# EAGLE design continuity_tester (EAGLE 6.6.0)
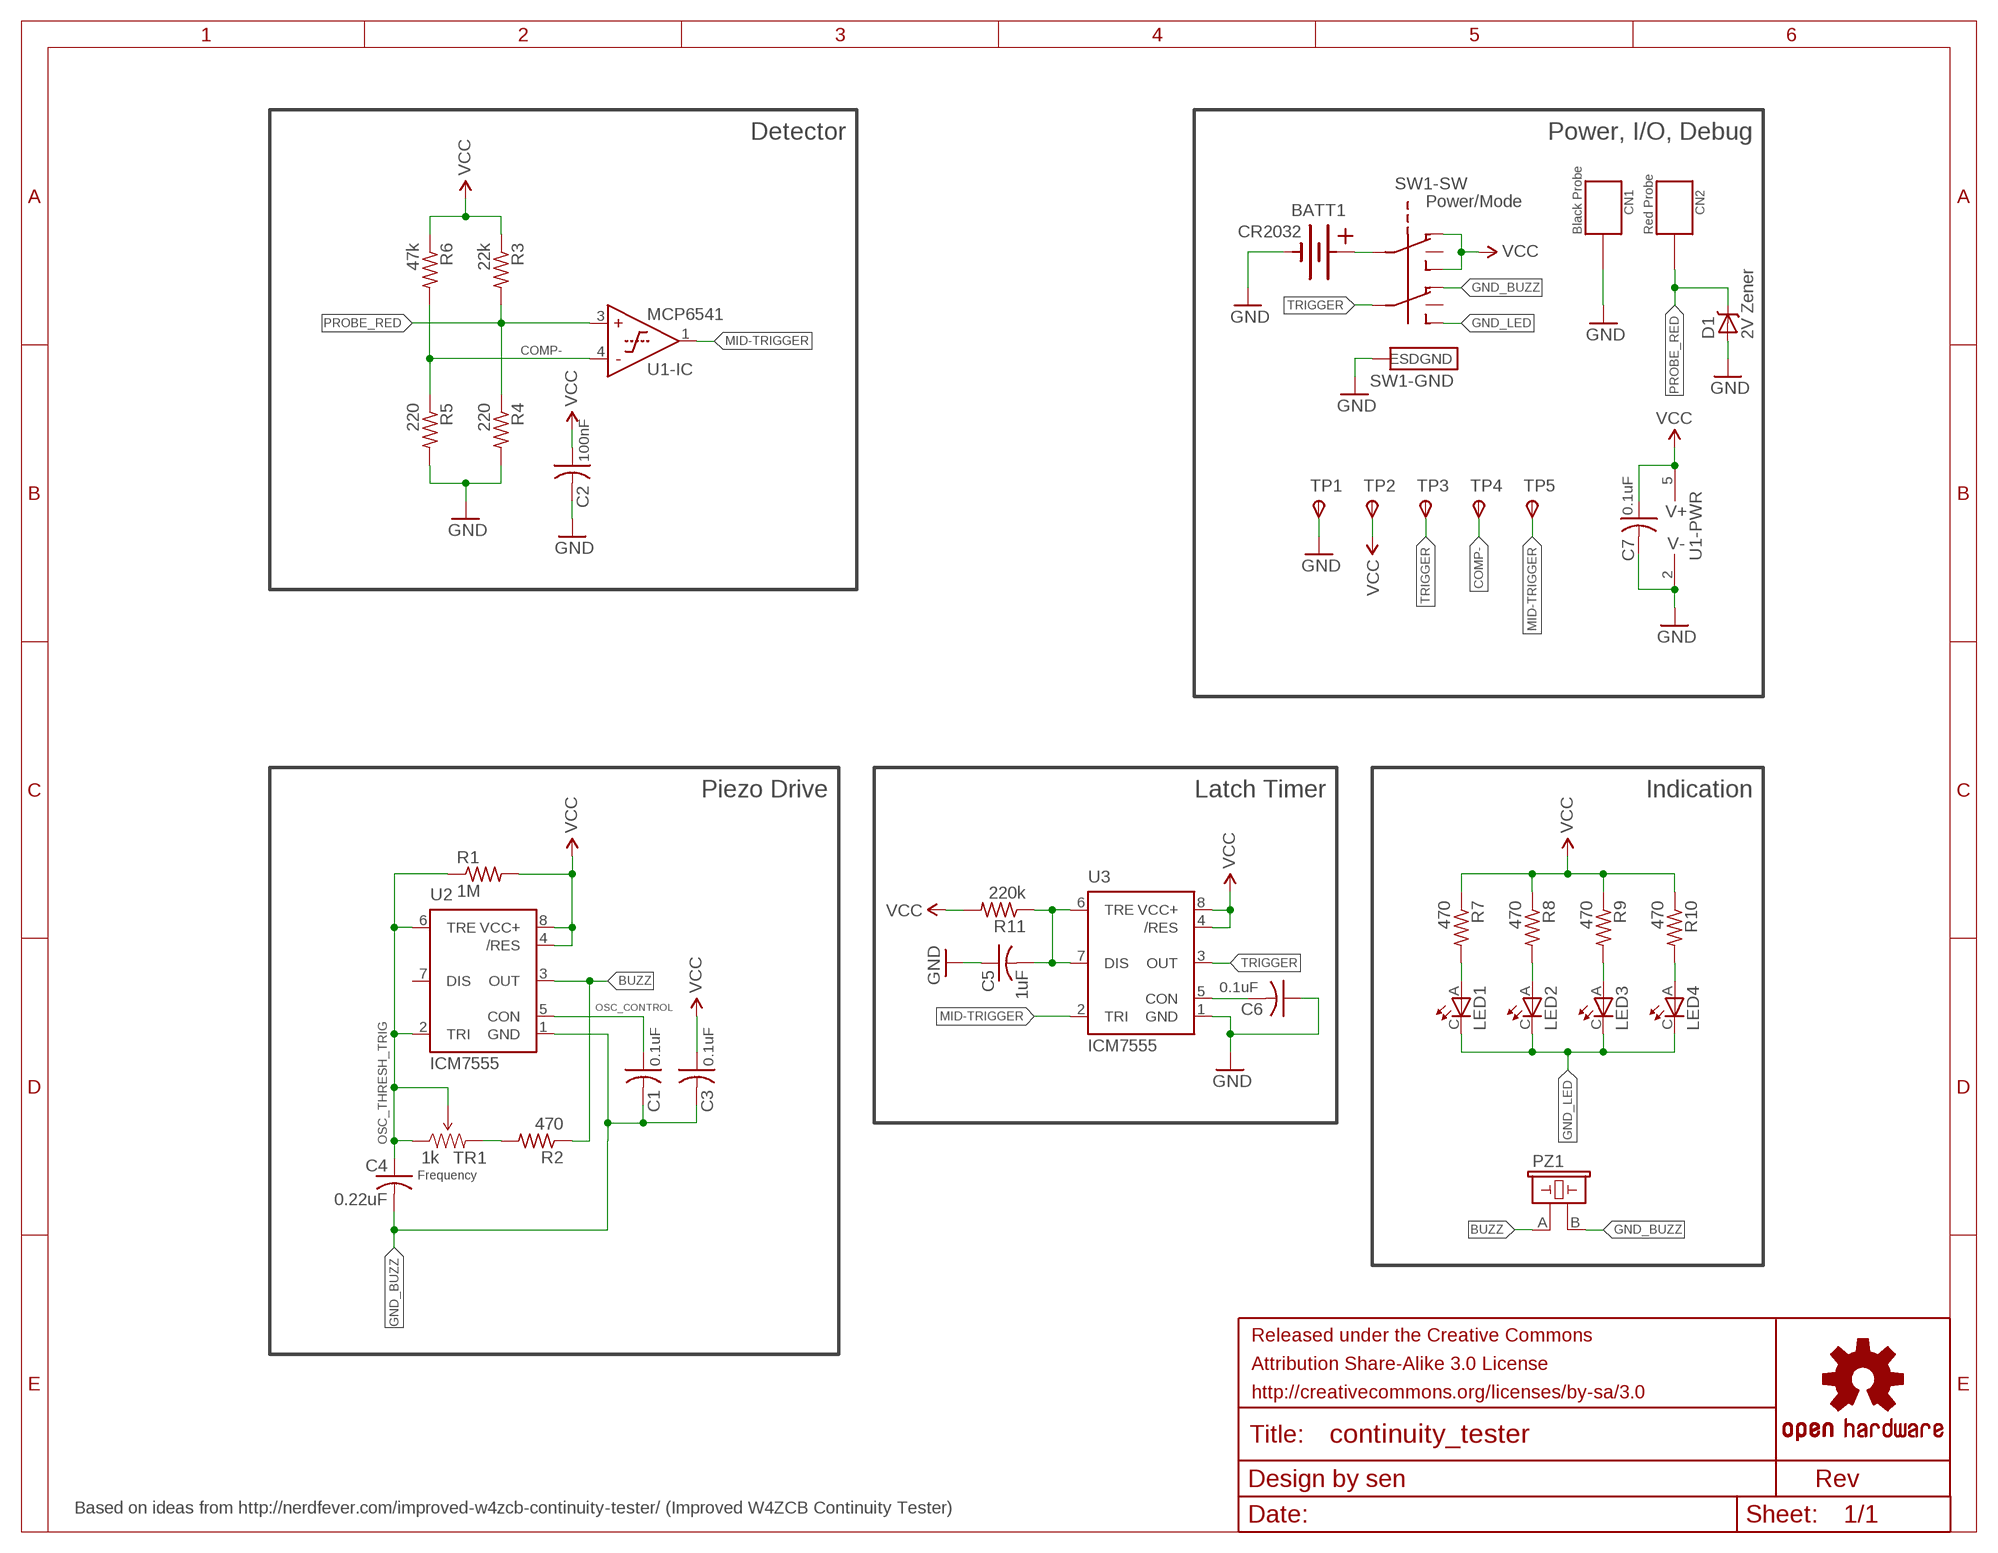
[diagram p0: schematic, sheet 1]

## Parts
BATT1  CR2032  [BK-912-CR2032]
C1  0.1uF  C-USC0603  [C0603]
C2  100nF  C-USC0603  [C0603]
C3  0.1uF  C-USC0603  [C0603]
C4  0.22uF  C-USC0603  [C0603]
C5  1uF  C-USC0603  [C0603]
C6  0.1uF  C-USC0603  [C0603]
C7  0.1uF  C-USC0603  [C0603]
CN1  Black Probe  CALTEST-CT3151  [CALTEST-CT3151]
CN2  Red Probe  CALTEST-CT3151  [CALTEST-CT3151]
D1  2V Zener  ZENER  [DO-219AC]
FRAME1  FRAME-LETTER-GRID-OSHW-SENOSHW-LOGO-L  [OSHW-LOGO-L]
LED1  LITEON-LTST020  [LITEON-LTST020]
LED2  LITEON-LTST020  [LITEON-LTST020]
LED3  LITEON-LTST020  [LITEON-LTST020]
LED4  LITEON-LTST020  [LITEON-LTST020]
PZ1  MURATA-PKMCS0909  [MURATA-PKMCS0909]
R1  1M  R-US_R0603  [R0603]
R2  470  R-US_R0603  [R0603]
R3  22k  R-US_R0603  [R0603]
R4  220  R-US_R0603  [R0603]
R5  220  R-US_R0603  [R0603]
R6  47k  R-US_R0603  [R0603]
R7  470  R-US_R0603  [R0603]
R8  470  R-US_R0603  [R0603]
R9  470  R-US_R0603  [R0603]
R10  470  R-US_R0603  [R0603]
R11  220k  R-US_R0603  [R0603]
SW1  Power/Mode  ESWITCH-EG2308  [ESWITCH-EG2308]
TP1  GND  TPSB1,27  [B1,27]
TP2  VCC  TPSB1,27  [B1,27]
TP3  TRIGGER  TPSB1,27  [B1,27]
TP4  COMP-  TPSB1,27  [B1,27]
TP5  MID-TRIGGER  TPSB1,27  [B1,27]
TR1  1k  NIDEC-ST4EA  [NIDEC-ST4EA]
U1  MCP6541  [SOT23-5]
U2  ICM7555  NE555D  [SO08]
U3  ICM7555  NE555D  [SO08]

## Nets
BUZZ: PZ1.A R2.1 U2.3(OUT)
COMP-: R5.1 R6.2 TP4.TP(PP) U1.4(-IC:IN-)
GND: BATT1.-(-1) C2.2 C5.1 C6.1 C7.2 CN1.A CN1.B CN1.C CN1.D D1.A R4.2 R5.2 SW1.SUPPORT1(-GND:ESDGND) SW1.SUPPORT2(-GND:ESDGND) TP1.TP(PP) U1.2(-PWR:V-) U3.1(GND)
GND_BUZZ: C1.2 C3.2 C4.2 PZ1.B SW1.5(-SW:2A) U2.1(GND)
GND_LED: LED1.C LED2.C LED3.C LED4.C SW1.8(-SW:2C)
LED1_R: LED1.A R7.2
LED2_R: LED2.A R8.2
LED3_R: LED3.A R9.2
LED4_R: LED4.A R10.2
MID-TRIGGER: TP5.TP(PP) U1.1(-IC:OUT) U3.2(TRI)
OSC_CONTROL: C1.1 U2.5(CON)
OSC_THRESH_TRIG: C4.1 R1.1 TR1.CCW TR1.WIPER U2.2(TRI) U2.6(TRE)
PROBE_RED: CN2.A CN2.B CN2.C CN2.D D1.K(C) R3.2 R4.1 U1.3(-IC:IN+)
TR1_R2: R2.2 TR1.CW
TRIGGER: SW1.7 TP3.TP(PP) U3.3(OUT)
U3-CON: C6.2 U3.5(CON)
U3-TREDIS: C5.2 R11.1 U3.6(TRE) U3.7(DIS)
VCC: C2.1 C3.1 C7.1 R1.2 R3.1 R6.1 R7.1 R8.1 R9.1 R10.1 R11.2 SW1.1(-SW:1A) SW1.4(-SW:1C) TP2.TP(PP) U1.5(-PWR:V+) U2.4(/RES) U2.8(VCC+) U3.4(/RES) U3.8(VCC+)
VCC_PRESWITCH: BATT1.+1(+2) SW1.3
Unconnected: SW1.2(-SW:1B) SW1.6(-SW:2B) U2.7(DIS)

## Notes on the sheet
- Detector | Power, I/O, Debug
- Piezo Drive | Latch Timer | Indication
- Frequency
- Based on ideas from http://nerdfever.com/improved-w4zcb-continuity-tester/ (Improved W4ZCB Continuity Tester)

## Library data of the parts
BATT1 = con-sen:CR2032
C1-C7 = adafruit:C-US: CAPACITOR, American symbol
CN1 CN2 = con-sen:CALTEST-CT3151: Cal Test CT3151 safety banana jack
D1 = diode-sen:ZENER: Zener diode in various packages.
FRAME1 = logos-sen:FRAME-LETTER-GRID-OSHW-SEN: Landscape letter-sized schematic frame w/ OSHW logo, edge grid; REV: 002
LED1-LED4 = led-sen:LITEON-LTST020: Right-angle SMD LED
PZ1 = speaker-sen:MURATA-PKMCS0909: Externally excited piezo transducer
R1-R11 = adafruit:R-US_: RESISTOR, American symbol
SW1 = switch-sen:ESWITCH-EG2308: DP3T Slide Switch
TP1-TP5 = testpad:TPS: TEST PIN
TR1 = rcl-sen:NIDEC-ST4EA: SMD trimpot
U1 = microchip-sen:MCP6541: MCP6541 Push-Pull Output Sub-Microamp Comparator
U2 U3 = SparkFun-AnalogIC:NE555: General purpose bipolar Timer

## Board
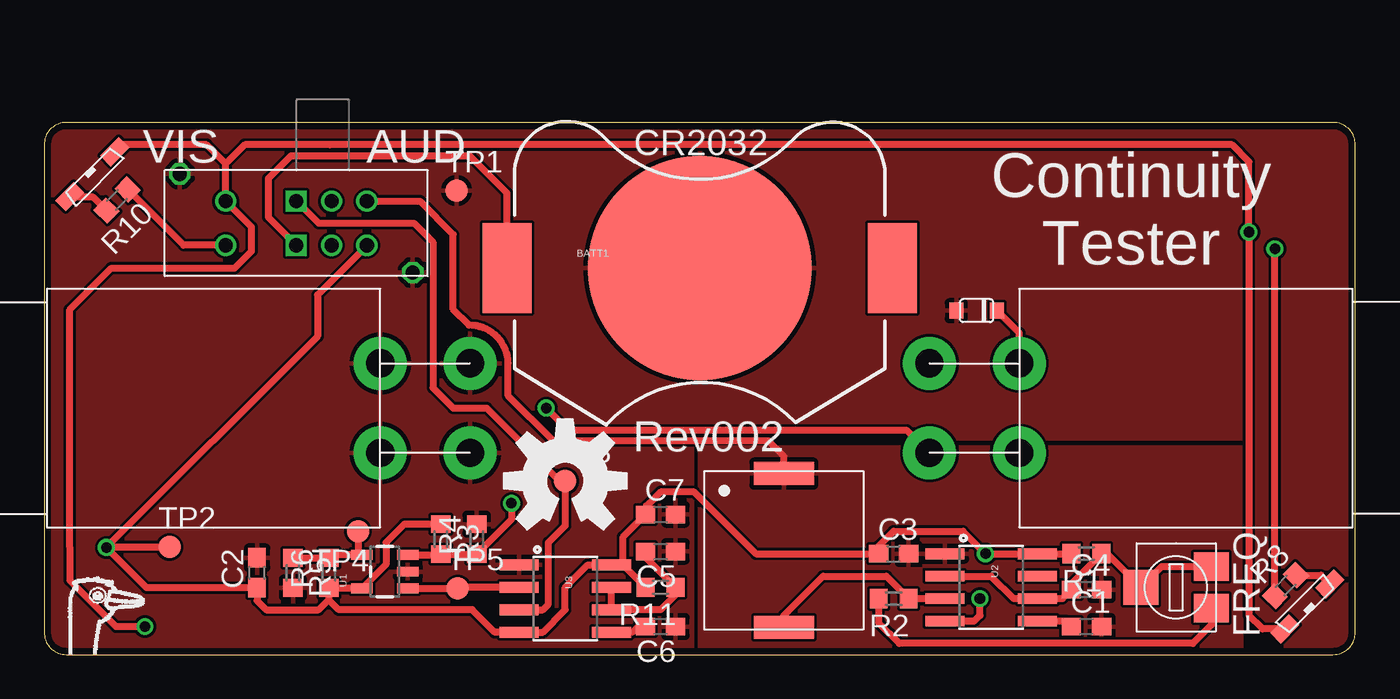
[diagram p1: board, top side]
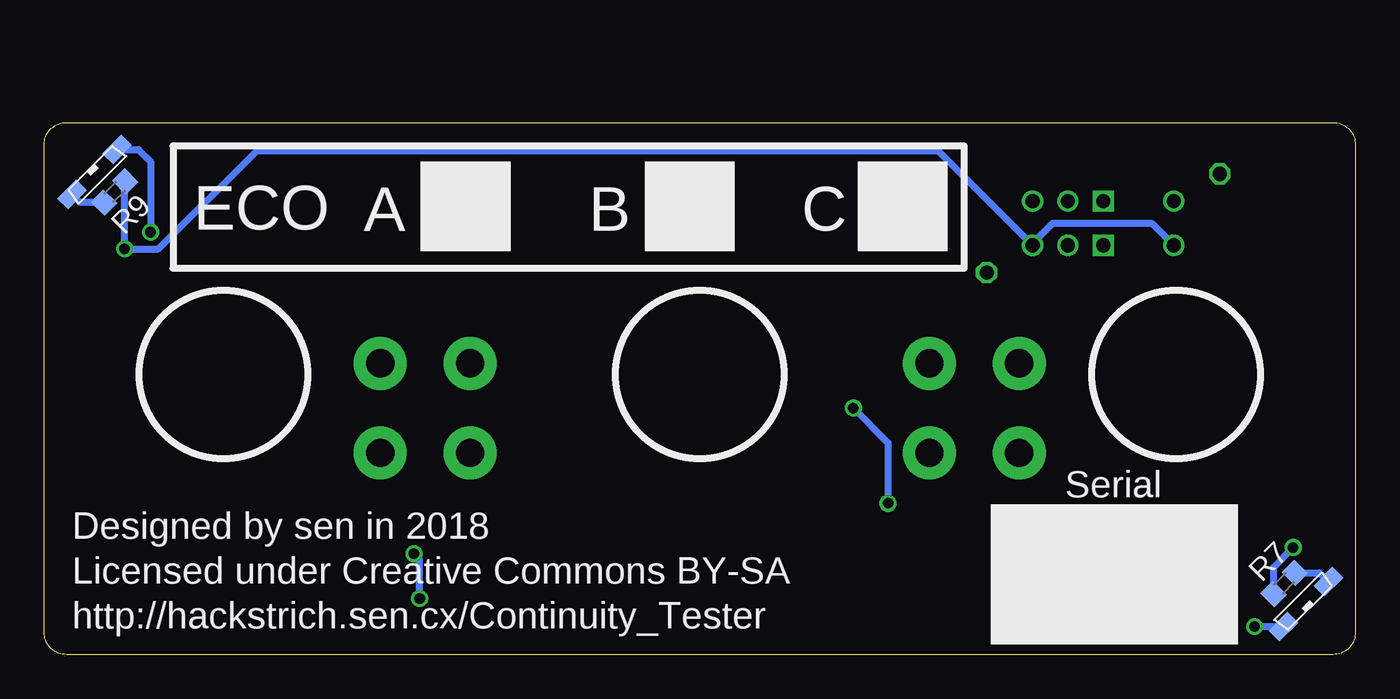
[diagram p2: board, bottom side, seen from below]

Size 74.3 x 30.16 mm. Coordinates in mm from the lower left corner, seen from the top.
Outline: 0,28.89 0,1.27 arc90 1.27,0 73.03,0 arc90 74.3,1.27 74.3,28.89 arc90 73.03,30.16 1.27,30.16 arc90 0,28.89
Copper layers (1*16): Top 0.0356mm / dielectric 1.5011mm / Bottom 0.0356mm
Design rules "LaenPCBOrder-sen *": minimum track width 6mil, minimum drill 13mil, track to track 6mil, track to pad 6mil, pad to pad 6mil, via to via 6mil, smd to smd 6mil, copper to edge 15mil, drill to drill 6mil, minimum pad ring 7mil, minimum via ring 7mil, stop-mask expansion 4mil, vias tented up to drill 25mil, thermal gap 10mil

### Footprints (pad centres in the part's own frame; a part is rotated, then mirrored left to right if it is on the bottom)
BK-912-CR2032 = smd 2.794 x 5.08: +1 -10.922,0; +2 10.922,0 | smd 12.7 x 12.7: - 0,0
C0603 = smd 1.1 x 1: 1 -0.85,0; 2 0.85,0
CALTEST-CT3151 = drill 1.6 pad 3: A 0,2.54; B 5.08,2.54; C 0,-2.54; D 5.08,-2.54
DO-219AC = smd 0.8 x 0.9: A 1.15,0; K -1.15,0
LITEON-LTST020 = smd 1.5 x 0.85: A 1.8,0; C -1.8,0
MURATA-PKMCS0909 = smd 1.3 x 3.4: A -4.35,0; B 4.35,0
R0603 = smd 1 x 1.1: 1 -0.85,0; 2 0.85,0
ESWITCH-EG2308 = drill 0.8: 1 -4,1.25; 2 -2,1.25; 4 4,1.25; 5 -4,-1.25; 6 -2,-1.25; 8 4,-1.25 | drill 0.8 square: 3 0,1.25; 7 0,-1.25 | drill 0.8 octagon: SUPPORT1 -6.6,2.8; SUPPORT2 6.6,-2.8
B1,27 = smd 1.27 x 1.27: TP 0,0
NIDEC-ST4EA = smd 1.6 x 2: CCW 1.175,-2; CW -1.175,-2 | smd 2 x 2: WIPER 0,2
SOT23-5 = smd 0.55 x 1.2: 1 -0.95,-1.3; 2 0,-1.3; 3 0.95,-1.3; 4 0.95,1.3; 5 -0.95,1.3
SO08 = smd 0.61 x 2.21: 1 -1.905,-2.616; 2 -0.635,-2.616; 3 0.635,-2.616; 4 1.905,-2.616; 5 1.905,2.616; 6 0.635,2.616; 7 -0.635,2.616; 8 -1.905,2.616

### Placement (x,y rotation side)
BATT1  37.15,21.91 0 top
C1  59.05,1.59 0 top
C2  12.06,4.64 90 top
C3  48.13,5.71 0 top
C4  59.05,3.68 0 top
C5  34.92,5.84 180 top
C6  34.92,1.59 180 top
C7  34.92,7.94 0 top
CN1  19.05,13.97 0 top
CN2  55.24,13.97 180 top
D1  52.83,19.49 180 top
FRAME1  29.53,9.84 0 top
LED1  2.8,2.86 45 bottom
LED2  71.57,2.73 45 top
LED3  71.44,27.36 225 bottom
LED4  2.73,27.23 225 top
PZ1  41.91,5.91 90 top
R1  59.05,5.71 180 top
R2  48.13,3.17 180 top
R3  22.48,6.54 270 top
R4  24.51,6.54 90 top
R5  14.1,4.64 270 top
R6  16.13,4.64 90 top
R7  4.03,4.03 45 bottom
R8  70.34,3.9 45 top
R9  70.3,26.22 225 bottom
R10  4.13,25.77 225 top
R11  34.92,3.81 180 top
SW1  14.29,24.45 180 top
TP1  23.37,26.29 0 top
TP2  7.11,6.1 0 top
TP3  29.53,9.84 0 top
TP4  17.78,6.99 180 top
TP5  23.43,3.75 0 top
TR1  64.14,3.81 90 top
U1  19.3,4.7 90 top
U2  53.66,3.81 270 top
U3  29.53,3.17 270 top
U$1  [STRICH-LOGO-R]  2.16,2.03 0 top

### Tracks (layer width: path | path; a pad name or v marks a point on that pad's centre or on a via)
BUZZ
  Top 0.406: U2.3 R2.1 47.71,4.45 44.13,4.45 41.91,2.22 PZ1.A
COMP-
  Top 0.406: R5.1 R6.2 16.29,5.65 U1.4 17.78,5.87 TP4.TP
GND
  pour Top: 0,30.16 74.3,30.16 74.3,0 68.26,0 68.26,12.26 36.7,12.26 36.7,0.32 0,0
GND_BUZZ
  Top 0.406: SW1.5 21.29,25.7 23.18,23.81 23.18,19.56 24.07,18.67 arc-90 26.29,16.51 26.29,14.67 28.83,12.13 41.02,12.13 41.91,11.24 PZ1.B
  pour Top: 37.15,11.75 67.82,11.75 67.82,0.32 37.15,0.32
GND_LED  (via drill 0.6)
  Top 0.406: LED4.C 4.39,28.89 9.21,28.89 10.29,27.81 | 10.29,27.81 SW1.8 11.75,24.24 11.75,22.86 10.79,21.91 3.81,21.91 1.45,19.55 1.45,6.07 1.45,4.21 LED1.C v5.71,1.58 | 10.29,27.81 11.37,28.89 16.19,28.89 67.31,28.89 68.27,27.94 v68.27,23.95 68.27,2.23 69.04,1.45 LED2.C
  Bottom 0.406: LED3.C 68.96,28.63 68.27,27.94 v68.27,23.95 | LED1.C v5.71,1.58
LED1_R
  Bottom 0.406: R7.2 2.04,4.64 LED1.A
LED2_R
  Top 0.406: R8.2 72.34,4.5 LED2.A
LED3_R
  Bottom 0.406: R9.2 72.24,25.62 LED3.A
LED4_R
  Top 0.406: LED4.A 2.74,25.95 R10.2
MID-TRIGGER
  Top 0.406: U1.1 TP5.TP 23.5,3.81 U3.2
OSC_CONTROL
  Top 0.406: U2.5 57.89,1.91 C1.1
OSC_THRESH_TRIG
  Top 0.406: TR1.CCW 63.31,4.99 TR1.WIPER 60.23,5.71 R1.1 58.2,4.01 C4.1 57.7,3.17 U2.6 54.93,3.17 53.66,4.45 U2.2
PROBE_RED  (via drill 0.6)
  Top 0.406: U1.3 22.44,5.65 R3.2 R4.1 25.49,6.67 26.48,7.66 v26.48,8.57 | CN2.C 55.24,18.23 D1.K | CN2.B 48.9,12.7 29.78,12.7 29.72,12.7 v28.45,13.97
  Bottom 0.406: v28.45,13.97 26.48,12 v26.48,8.57
TR1_R2
  Top 0.406: TR1.CW 66.14,1.68 65.09,0.64 48.45,0.64 47.28,1.8 R2.2
TRIGGER
  Top 0.406: U3.3 28.26,2.54 28.57,2.86 28.57,6.35 29.53,7.3 TP3.TP 29.53,9.53 25.08,13.97 23.18,13.97 22.04,15.11 22.04,23.37 20.95,24.45 15.56,24.45 14.31,25.7 SW1.7
U3-CON
  Top 0.406: C6.2 33.66,1.59 33.34,1.27 U3.5
U3-TREDIS
  Top 0.406: U3.7 U3.6 34.92,2.54 35.77,3.39 R11.1 34.08,5.51 C5.2
VCC  (via drill 0.6)
  Top 0.406: U2.4 52.39,1.91 52.7,1.91 53.02,2.22 v53.02,3.17 | v53.34,5.71 U2.8 R1.2 | 16.13,3.11 R6.1 16.17,3.75 U1.5 19.37,5.11 19.37,6.35 20.41,7.39 R3.1 | 16.13,3.11 15.56,2.54 12.57,2.54 12.06,3.05 C2.1 5.81,3.79 v3.53,6.07 3.56,6.1 | v53.34,5.71 52.07,6.99 48.13,6.99 47.28,6.13 C3.1 40.32,5.71 36.83,9.21 34.92,9.21 34.29,8.57 34.08,8.36 | 32.8,5.08 U3.8 30.8,5.08 29.53,3.81 29.53,2.54 28.26,1.27 U3.4 25.53,1.27 24.26,2.54 16.7,2.54 16.13,3.11 | 32.8,5.08 R11.2 | SW1.4 7.9,23.2 R10.1 | SW1.1 18.29,23.18 | 18.29,23.18 15.49,20.38 15.49,18.03 3.56,6.1 | 18.31,23.18 SW1.1 | 32.8,5.08 32.8,6.67 C7.1 | 3.56,6.1 TP2.TP | R8.1 v69.74,23 | C7.1 34.08,8.36 | 18.29,23.18 SW1.1 | C7.1 34.08,8.36 | 53.59,5.71 v53.34,5.71
  Bottom 0.406: v53.02,3.17 53.02,5.4 v53.34,5.71 | SW1.1 18.29,23.3 17.14,24.45 11.54,24.45 SW1.4 | R9.1 69.74,26.78 v69.74,23 v69.73,23 69.72,22.99 67.82,22.99 62.23,28.57 24.13,28.57 23.66,28.57 SW1.1 | R7.1 4.64,4.96 v3.53,6.07 | 18.29,23.18 SW1.1
VCC_PRESWITCH
  Top 0.406: BATT1.+1 26.23,26.16 24.13,28.26 13.97,28.26 12.7,26.99 12.7,24.79 SW1.3

### Text on the board
tPlace: VIS | AUD | CR2032 | Continuity / Tester | Rev002 | FREQ
bPlace: C | B | A | ECO | Serial | Designed by sen in 2018 | Licensed under Creative Commons BY-SA | http://hackstrich.sen.cx/Continuity_Tester